# Altium project PCB_Project.PrjPcb
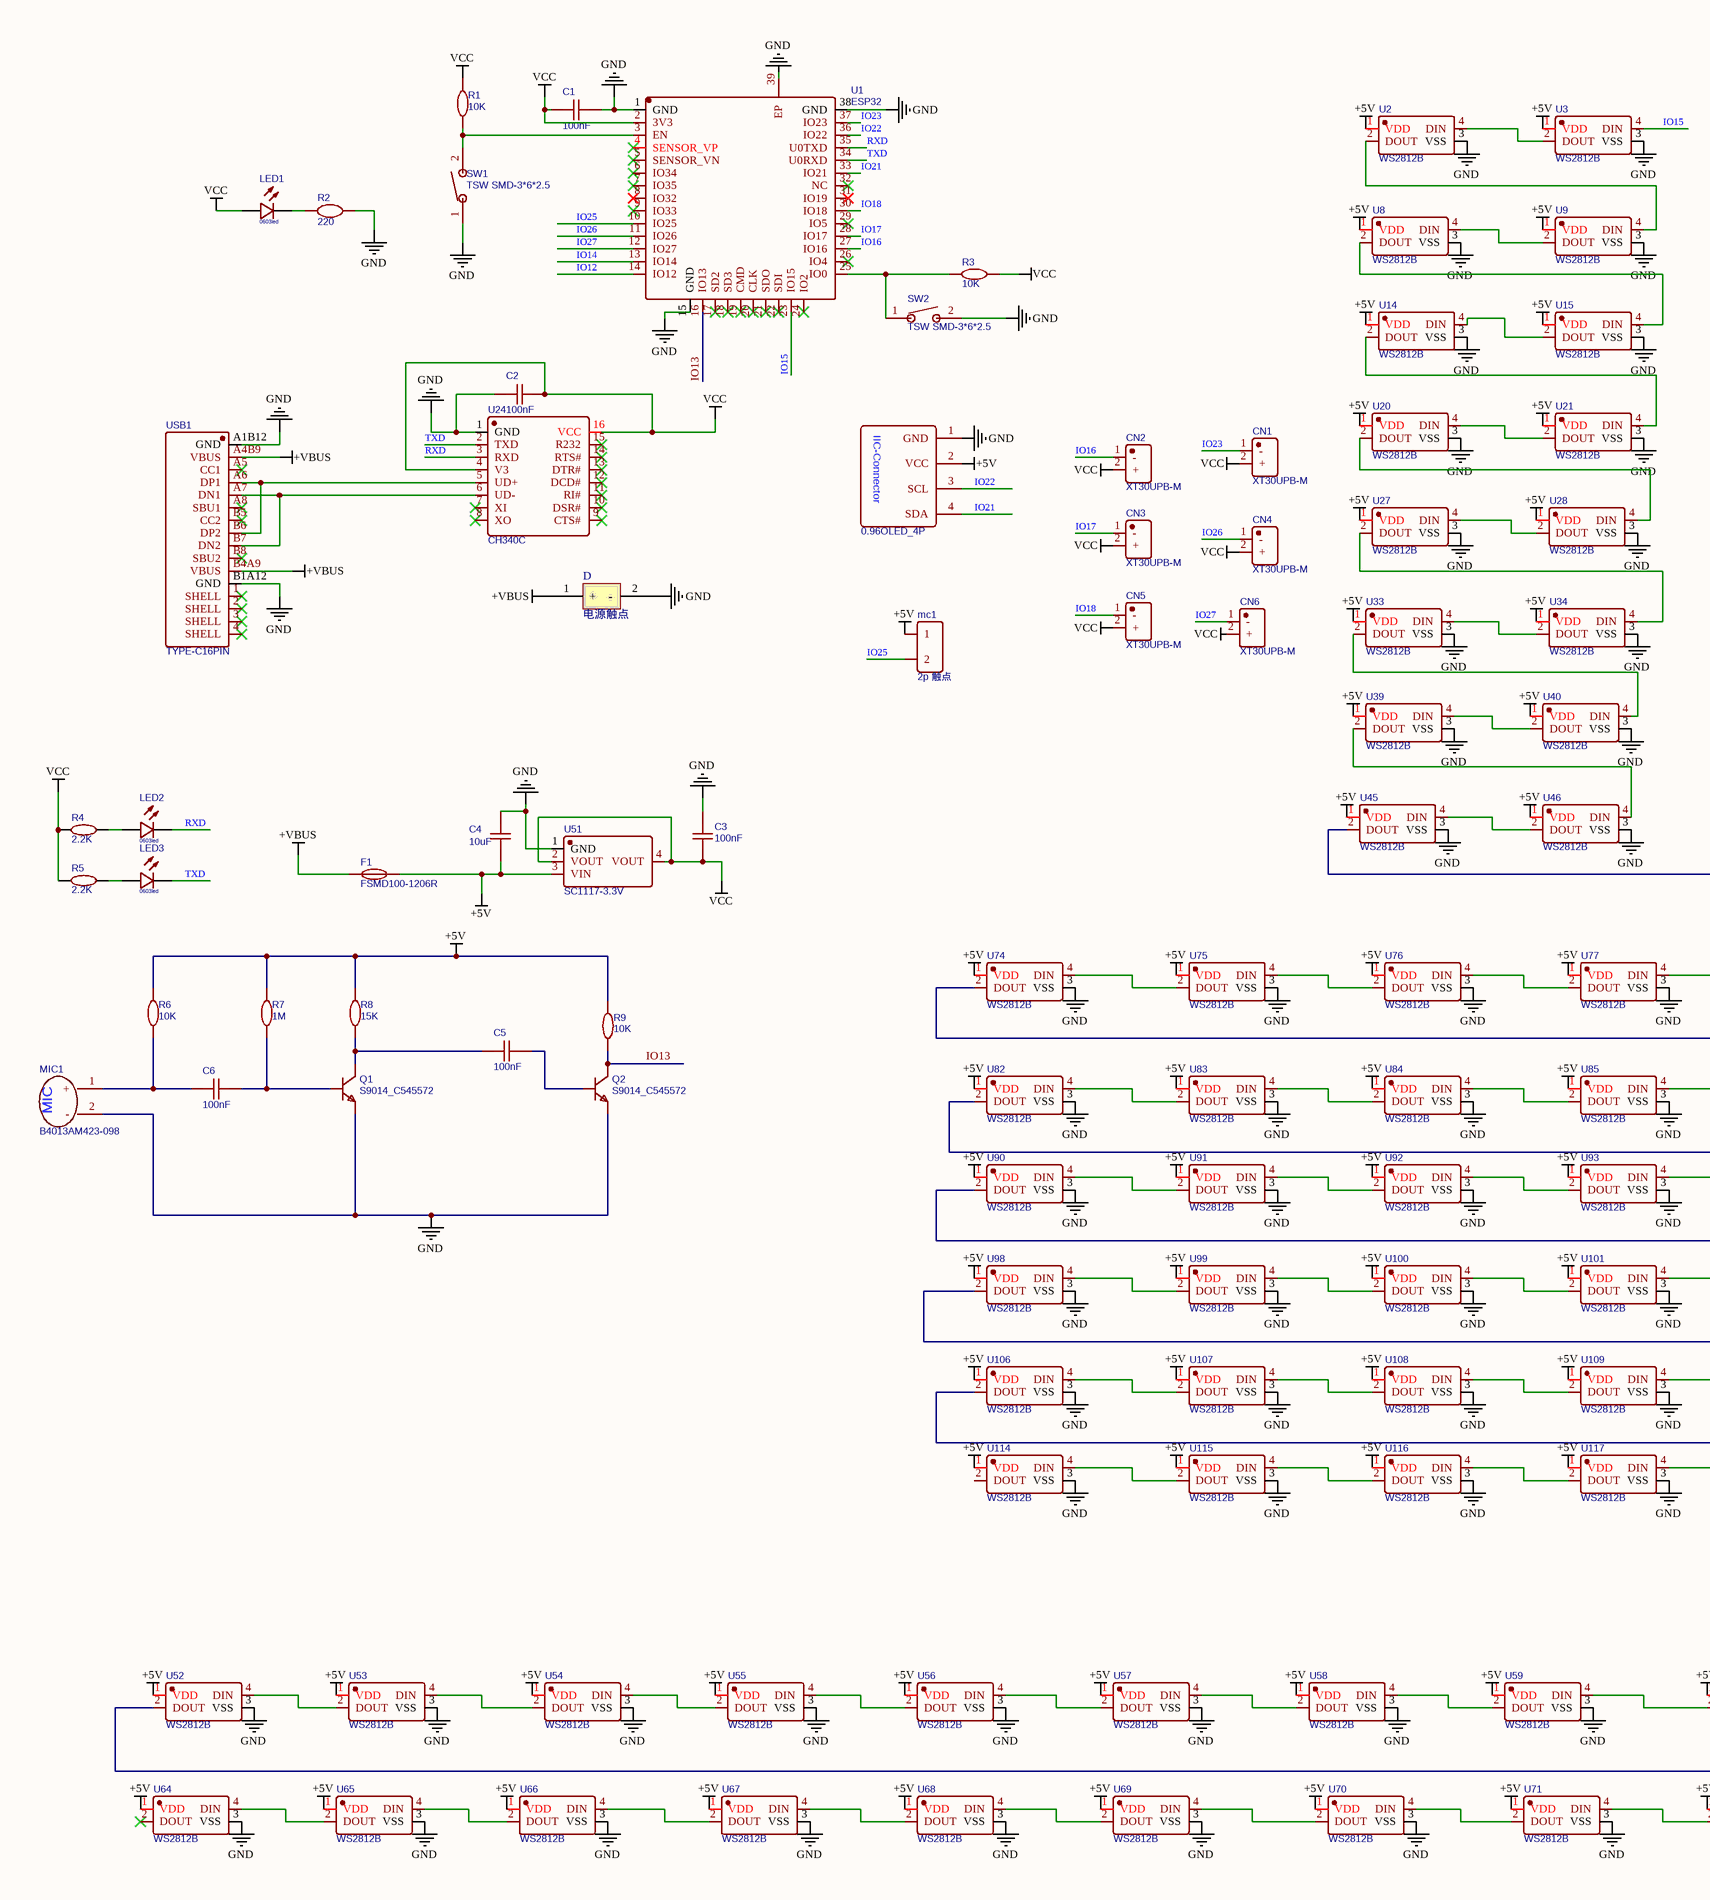
[diagram p0: Sheet1.SchDoc, left]
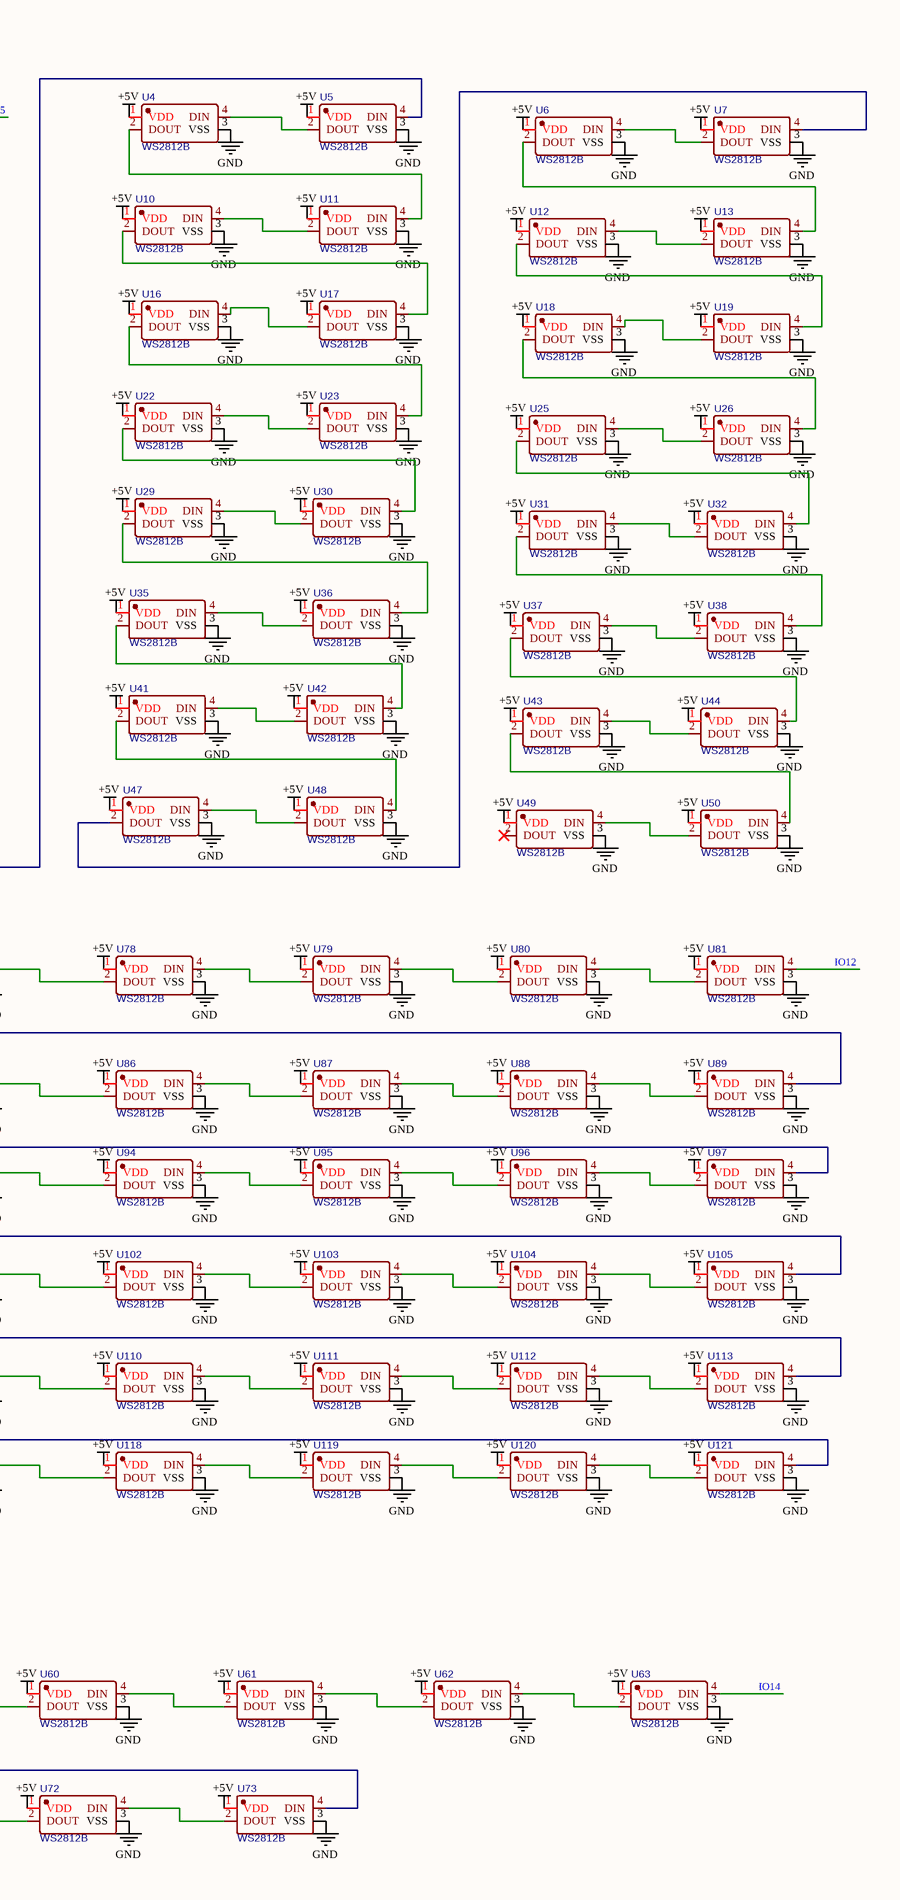
[diagram p1: Sheet1.SchDoc, right]
1 sheet, 155 parts. Net scope: global (net labels, ports and power ports of the same name join across sheets).
Board files: PCB1.PcbDoc, PCB2.PcbDoc, PCB3.PcbDoc, PCB4.PcbDoc, PCB5.PcbDoc, PCB6.PcbDoc, PCB7.PcbDoc

## Sheet Sheet1.SchDoc
size A2

### Parts
?  0.96OLED_4P  [OLED]
C1  100nF  [C 0603_M]
C2  100nF  [C 0603_M]
C3  100nF  [C 0603_M]
C4  10uF  [C 0603_M]
C5  100nF  [C 0603_M]
C6  100nF  [C 0603_M]
CN1  XT30UPB-M  [XT30UPB-M]
CN2  XT30UPB-M  [XT30UPB-M]
CN3  XT30UPB-M  [XT30UPB-M]
CN4  XT30UPB-M  [XT30UPB-M]
CN5  XT30UPB-M  [XT30UPB-M]
CN6  XT30UPB-M  [XT30UPB-M]
D  电源触点  [触点]
F1  FSMD100-1206R  [FSMD100-1206R]
LED1  0603led  [LED]
LED2  0603led  [LED]
LED3  0603led  [LED]
mc1  2p 触点  [PCBComponent_1]
MIC1  B4013AM423-098  [MIC-SMD_BD4.0]
Q1  S9014_C545572  [SOT23]
Q2  S9014_C545572  [SOT23]
R1  10K  [R 0603_L]
R2  220  [R 0603_L]
R3  10K  [R 0603_L]
R4  2.2K  [R 0603_L]
R5  2.2K  [R 0603_L]
R6  10K  [R 0603_L]
R7  1M  [R 0603_L]
R8  15K  [R 0603_L]
R9  10K  [R 0603_L]
SW1  TSW SMD-3*6*2.5  [TSW SMD-3*6*2.5]
SW2  TSW SMD-3*6*2.5  [TSW SMD-3*6*2.5]
U1  ESP32  [ESP32]
U2  WS2812B  [WS2812B_5050]
U3  WS2812B  [WS2812B_5050]
U4  WS2812B  [WS2812B_5050]
U5  WS2812B  [WS2812B_5050]
U6  WS2812B  [WS2812B_5050]
U7  WS2812B  [WS2812B_5050]
U8  WS2812B  [WS2812B_5050]
U9  WS2812B  [WS2812B_5050]
U10  WS2812B  [WS2812B_5050]
U11  WS2812B  [WS2812B_5050]
U12  WS2812B  [WS2812B_5050]
U13  WS2812B  [WS2812B_5050]
U14  WS2812B  [WS2812B_5050]
U15  WS2812B  [WS2812B_5050]
U16  WS2812B  [WS2812B_5050]
U17  WS2812B  [WS2812B_5050]
U18  WS2812B  [WS2812B_5050]
U19  WS2812B  [WS2812B_5050]
U20  WS2812B  [WS2812B_5050]
U21  WS2812B  [WS2812B_5050]
U22  WS2812B  [WS2812B_5050]
U23  WS2812B  [WS2812B_5050]
U24  CH340C  [CH340C]
U25  WS2812B  [WS2812B_5050]
U26  WS2812B  [WS2812B_5050]
U27  WS2812B  [WS2812B_5050]
U28  WS2812B  [WS2812B_5050]
U29  WS2812B  [WS2812B_5050]
U30  WS2812B  [WS2812B_5050]
U31  WS2812B  [WS2812B_5050]
U32  WS2812B  [WS2812B_5050]
U33  WS2812B  [WS2812B_5050]
U34  WS2812B  [WS2812B_5050]
U35  WS2812B  [WS2812B_5050]
U36  WS2812B  [WS2812B_5050]
U37  WS2812B  [WS2812B_5050]
U38  WS2812B  [WS2812B_5050]
U39  WS2812B  [WS2812B_5050]
U40  WS2812B  [WS2812B_5050]
U41  WS2812B  [WS2812B_5050]
U42  WS2812B  [WS2812B_5050]
U43  WS2812B  [WS2812B_5050]
U44  WS2812B  [WS2812B_5050]
U45  WS2812B  [WS2812B_5050]
U46  WS2812B  [WS2812B_5050]
U47  WS2812B  [WS2812B_5050]
U48  WS2812B  [WS2812B_5050]
U49  WS2812B  [WS2812B_5050]
U50  WS2812B  [WS2812B_5050]
U51  SC1117-3.3V  [SC1117-3.3V]
U52  WS2812B  [WS2812B_5050]
U53  WS2812B  [WS2812B_5050]
U54  WS2812B  [WS2812B_5050]
U55  WS2812B  [WS2812B_5050]
U56  WS2812B  [WS2812B_5050]
U57  WS2812B  [WS2812B_5050]
U58  WS2812B  [WS2812B_5050]
U59  WS2812B  [WS2812B_5050]
U60  WS2812B  [WS2812B_5050]
U61  WS2812B  [WS2812B_5050]
U62  WS2812B  [WS2812B_5050]
U63  WS2812B  [WS2812B_5050]
U64  WS2812B  [WS2812B_5050]
U65  WS2812B  [WS2812B_5050]
U66  WS2812B  [WS2812B_5050]
U67  WS2812B  [WS2812B_5050]
U68  WS2812B  [WS2812B_5050]
U69  WS2812B  [WS2812B_5050]
U70  WS2812B  [WS2812B_5050]
U71  WS2812B  [WS2812B_5050]
U72  WS2812B  [WS2812B_5050]
U73  WS2812B  [WS2812B_5050]
U74  WS2812B  [WS2812B_5050]
U75  WS2812B  [WS2812B_5050]
U76  WS2812B  [WS2812B_5050]
U77  WS2812B  [WS2812B_5050]
U78  WS2812B  [WS2812B_5050]
U79  WS2812B  [WS2812B_5050]
U80  WS2812B  [WS2812B_5050]
U81  WS2812B  [WS2812B_5050]
U82  WS2812B  [WS2812B_5050]
U83  WS2812B  [WS2812B_5050]
U84  WS2812B  [WS2812B_5050]
U85  WS2812B  [WS2812B_5050]
U86  WS2812B  [WS2812B_5050]
U87  WS2812B  [WS2812B_5050]
U88  WS2812B  [WS2812B_5050]
U89  WS2812B  [WS2812B_5050]
U90  WS2812B  [WS2812B_5050]
U91  WS2812B  [WS2812B_5050]
U92  WS2812B  [WS2812B_5050]
U93  WS2812B  [WS2812B_5050]
U94  WS2812B  [WS2812B_5050]
U95  WS2812B  [WS2812B_5050]
U96  WS2812B  [WS2812B_5050]
U97  WS2812B  [WS2812B_5050]
U98  WS2812B  [WS2812B_5050]
U99  WS2812B  [WS2812B_5050]
U100  WS2812B  [WS2812B_5050]
U101  WS2812B  [WS2812B_5050]
U102  WS2812B  [WS2812B_5050]
U103  WS2812B  [WS2812B_5050]
U104  WS2812B  [WS2812B_5050]
U105  WS2812B  [WS2812B_5050]
U106  WS2812B  [WS2812B_5050]
U107  WS2812B  [WS2812B_5050]
U108  WS2812B  [WS2812B_5050]
U109  WS2812B  [WS2812B_5050]
U110  WS2812B  [WS2812B_5050]
U111  WS2812B  [WS2812B_5050]
U112  WS2812B  [WS2812B_5050]
U113  WS2812B  [WS2812B_5050]
U114  WS2812B  [WS2812B_5050]
U115  WS2812B  [WS2812B_5050]
U116  WS2812B  [WS2812B_5050]
U117  WS2812B  [WS2812B_5050]
U118  WS2812B  [WS2812B_5050]
U119  WS2812B  [WS2812B_5050]
U120  WS2812B  [WS2812B_5050]
U121  WS2812B  [WS2812B_5050]
USB1  TYPE-C16PIN  [TYPE-C16PIN]

### Nets
+5V: ?.2(VCC) C4.1 F1.2 mc1.1 R6.2 R7.2 R8.2 R9.2 U2.1(VDD) U3.1(VDD) U4.1(VDD) U5.1(VDD) U6.1(VDD) U7.1(VDD) U8.1(VDD) U9.1(VDD) U10.1(VDD) U11.1(VDD) U12.1(VDD) U13.1(VDD) U14.1(VDD) U15.1(VDD) U16.1(VDD) U17.1(VDD) U18.1(VDD) U19.1(VDD) U20.1(VDD) U21.1(VDD) U22.1(VDD) U23.1(VDD) U25.1(VDD) U26.1(VDD) U27.1(VDD) U28.1(VDD) U29.1(VDD) U30.1(VDD) U31.1(VDD) U32.1(VDD) U33.1(VDD) U34.1(VDD) U35.1(VDD) U36.1(VDD) U37.1(VDD) U38.1(VDD) U39.1(VDD) U40.1(VDD) U41.1(VDD) U42.1(VDD) U43.1(VDD) U44.1(VDD) U45.1(VDD) U46.1(VDD) U47.1(VDD) U48.1(VDD) U49.1(VDD) U50.1(VDD) U51.3(VIN) U52.1(VDD) U53.1(VDD) U54.1(VDD) U55.1(VDD) U56.1(VDD) U57.1(VDD) U58.1(VDD) U59.1(VDD) U60.1(VDD) U61.1(VDD) U62.1(VDD) U63.1(VDD) U64.1(VDD) U65.1(VDD) U66.1(VDD) U67.1(VDD) U68.1(VDD) U69.1(VDD) U70.1(VDD) U71.1(VDD) U72.1(VDD) U73.1(VDD) U74.1(VDD) U75.1(VDD) U76.1(VDD) U77.1(VDD) U78.1(VDD) U79.1(VDD) U80.1(VDD) U81.1(VDD) U82.1(VDD) U83.1(VDD) U84.1(VDD) U85.1(VDD) U86.1(VDD) U87.1(VDD) U88.1(VDD) U89.1(VDD) U90.1(VDD) U91.1(VDD) U92.1(VDD) U93.1(VDD) U94.1(VDD) U95.1(VDD) U96.1(VDD) U97.1(VDD) U98.1(VDD) U99.1(VDD) U100.1(VDD) U101.1(VDD) U102.1(VDD) U103.1(VDD) U104.1(VDD) U105.1(VDD) U106.1(VDD) U107.1(VDD) U108.1(VDD) U109.1(VDD) U110.1(VDD) U111.1(VDD) U112.1(VDD) U113.1(VDD) U114.1(VDD) U115.1(VDD) U116.1(VDD) U117.1(VDD) U118.1(VDD) U119.1(VDD) U120.1(VDD) U121.1(VDD)
+VBUS: D.1(+) F1.1 USB1.A4B9(VBUS) USB1.B4A9(VBUS)
GND: ?.1(GND) C1.2 C2.1 C3.2 C4.2 D.2(-) MIC1.2(-) Q1.2(E) Q2.2(E) R2.2 SW1.1 SW2.2 U1.1(GND) U1.15(GND) U1.38(GND) U1.39(EP) U2.3(VSS) U3.3(VSS) U4.3(VSS) U5.3(VSS) U6.3(VSS) U7.3(VSS) U8.3(VSS) U9.3(VSS) U10.3(VSS) U11.3(VSS) U12.3(VSS) U13.3(VSS) U14.3(VSS) U15.3(VSS) U16.3(VSS) U17.3(VSS) U18.3(VSS) U19.3(VSS) U20.3(VSS) U21.3(VSS) U22.3(VSS) U23.3(VSS) U24.1(GND) U25.3(VSS) U26.3(VSS) U27.3(VSS) U28.3(VSS) U29.3(VSS) U30.3(VSS) U31.3(VSS) U32.3(VSS) U33.3(VSS) U34.3(VSS) U35.3(VSS) U36.3(VSS) U37.3(VSS) U38.3(VSS) U39.3(VSS) U40.3(VSS) U41.3(VSS) U42.3(VSS) U43.3(VSS) U44.3(VSS) U45.3(VSS) U46.3(VSS) U47.3(VSS) U48.3(VSS) U49.3(VSS) U50.3(VSS) U51.1(GND) U52.3(VSS) U53.3(VSS) U54.3(VSS) U55.3(VSS) U56.3(VSS) U57.3(VSS) U58.3(VSS) U59.3(VSS) U60.3(VSS) U61.3(VSS) U62.3(VSS) U63.3(VSS) U64.3(VSS) U65.3(VSS) U66.3(VSS) U67.3(VSS) U68.3(VSS) U69.3(VSS) U70.3(VSS) U71.3(VSS) U72.3(VSS) U73.3(VSS) U74.3(VSS) U75.3(VSS) U76.3(VSS) U77.3(VSS) U78.3(VSS) U79.3(VSS) U80.3(VSS) U81.3(VSS) U82.3(VSS) U83.3(VSS) U84.3(VSS) U85.3(VSS) U86.3(VSS) U87.3(VSS) U88.3(VSS) U89.3(VSS) U90.3(VSS) U91.3(VSS) U92.3(VSS) U93.3(VSS) U94.3(VSS) U95.3(VSS) U96.3(VSS) U97.3(VSS) U98.3(VSS) U99.3(VSS) U100.3(VSS) U101.3(VSS) U102.3(VSS) U103.3(VSS) U104.3(VSS) U105.3(VSS) U106.3(VSS) U107.3(VSS) U108.3(VSS) U109.3(VSS) U110.3(VSS) U111.3(VSS) U112.3(VSS) U113.3(VSS) U114.3(VSS) U115.3(VSS) U116.3(VSS) U117.3(VSS) U118.3(VSS) U119.3(VSS) U120.3(VSS) U121.3(VSS) USB1.A1B12(GND) USB1.B1A12(GND)
VCC: C1.1 C2.2 C3.1 CN1.2(+) CN2.2(+) CN3.2(+) CN4.2(+) CN5.2(+) LED1.1(A) R1.2 R3.2 R4.1 R5.1 U1.2(3V3) U24.4(V3) U24.16(VCC) U51.2(VOUT) U51.4(VOUT)
IO12: U1.14(IO12) U81.4(DIN)
IO13: Q2.3(C) R9.1 U1.16(IO13)
IO14: U1.13(IO14) U63.4(DIN)
IO15: U1.23(IO15) U3.4(DIN)
IO16: CN2.1(-) U1.27(IO16)
IO17: CN3.1(-) U1.28(IO17)
IO18: CN5.1(-) U1.30(IO18)
IO21: ?.4(SDA) U1.33(IO21)
IO22: ?.3(SCL) U1.36(IO22)
IO23: CN1.1(-) U1.37(IO23)
IO25: mc1.2 U1.10(IO25)
IO26: CN4.1(-) U1.11(IO26)
IO27: CN6.1(-) U1.12(IO27)
RXD: LED2.2(C) U1.35(U0TXD) U24.3(RXD)
TXD: LED3.2(C) U1.34(U0RXD) U24.2(TXD)
NetC5_1: C5.1 Q1.3(C) R8.1
NetC5_2: C5.2 Q2.1
NetC6_1: C6.1 MIC1.1(+) R6.1
NetC6_2: C6.2 Q1.1 R7.1
NetLED1_2: LED1.2(C) R2.1
NetLED2_1: LED2.1(A) R4.2
NetLED3_1: LED3.1(A) R5.2
NetR1_1: R1.1 SW1.2 U1.3(EN)
NetR3_1: R3.1 SW2.1 U1.25(IO0)
NetU2_2: U2.2(DOUT) U9.4(DIN)
NetU2_4: U2.4(DIN) U3.2(DOUT)
NetU4_2: U4.2(DOUT) U11.4(DIN)
NetU4_4: U4.4(DIN) U5.2(DOUT)
NetU5_4: U5.4(DIN) U45.2(DOUT)
NetU6_2: U6.2(DOUT) U13.4(DIN)
NetU6_4: U6.4(DIN) U7.2(DOUT)
NetU7_4: U7.4(DIN) U47.2(DOUT)
NetU8_2: U8.2(DOUT) U15.4(DIN)
NetU8_4: U8.4(DIN) U9.2(DOUT)
NetU10_2: U10.2(DOUT) U17.4(DIN)
NetU10_4: U10.4(DIN) U11.2(DOUT)
NetU12_2: U12.2(DOUT) U19.4(DIN)
NetU12_4: U12.4(DIN) U13.2(DOUT)
NetU14_2: U14.2(DOUT) U21.4(DIN)
NetU14_4: U14.4(DIN) U15.2(DOUT)
NetU16_2: U16.2(DOUT) U23.4(DIN)
NetU16_4: U16.4(DIN) U17.2(DOUT)
NetU18_2: U18.2(DOUT) U26.4(DIN)
NetU18_4: U18.4(DIN) U19.2(DOUT)
NetU20_2: U20.2(DOUT) U28.4(DIN)
NetU20_4: U20.4(DIN) U21.2(DOUT)
NetU22_2: U22.2(DOUT) U30.4(DIN)
NetU22_4: U22.4(DIN) U23.2(DOUT)
NetU24_5: U24.5(UD+) USB1.A6(DP1) USB1.B6(DP2)
NetU24_6: U24.6(UD-) USB1.A7(DN1) USB1.B7(DN2)
NetU25_2: U25.2(DOUT) U32.4(DIN)
NetU25_4: U25.4(DIN) U26.2(DOUT)
NetU27_2: U27.2(DOUT) U34.4(DIN)
NetU27_4: U27.4(DIN) U28.2(DOUT)
NetU29_2: U29.2(DOUT) U36.4(DIN)
NetU29_4: U29.4(DIN) U30.2(DOUT)
NetU31_2: U31.2(DOUT) U38.4(DIN)
NetU31_4: U31.4(DIN) U32.2(DOUT)
NetU33_2: U33.2(DOUT) U40.4(DIN)
NetU33_4: U33.4(DIN) U34.2(DOUT)
NetU35_2: U35.2(DOUT) U42.4(DIN)
NetU35_4: U35.4(DIN) U36.2(DOUT)
NetU37_2: U37.2(DOUT) U44.4(DIN)
NetU37_4: U37.4(DIN) U38.2(DOUT)
NetU39_2: U39.2(DOUT) U46.4(DIN)
NetU39_4: U39.4(DIN) U40.2(DOUT)
NetU41_2: U41.2(DOUT) U48.4(DIN)
NetU41_4: U41.4(DIN) U42.2(DOUT)
NetU43_2: U43.2(DOUT) U50.4(DIN)
NetU43_4: U43.4(DIN) U44.2(DOUT)
NetU45_4: U45.4(DIN) U46.2(DOUT)
NetU47_4: U47.4(DIN) U48.2(DOUT)
NetU49_4: U49.4(DIN) U50.2(DOUT)
NetU52_2: U52.2(DOUT) U73.4(DIN)
NetU52_4: U52.4(DIN) U53.2(DOUT)
NetU53_4: U53.4(DIN) U54.2(DOUT)
NetU54_4: U54.4(DIN) U55.2(DOUT)
NetU55_4: U55.4(DIN) U56.2(DOUT)
NetU56_4: U56.4(DIN) U57.2(DOUT)
NetU57_4: U57.4(DIN) U58.2(DOUT)
NetU58_4: U58.4(DIN) U59.2(DOUT)
NetU59_4: U59.4(DIN) U60.2(DOUT)
NetU60_4: U60.4(DIN) U61.2(DOUT)
NetU61_4: U61.4(DIN) U62.2(DOUT)
NetU62_4: U62.4(DIN) U63.2(DOUT)
NetU64_4: U64.4(DIN) U65.2(DOUT)
NetU65_4: U65.4(DIN) U66.2(DOUT)
NetU66_4: U66.4(DIN) U67.2(DOUT)
NetU67_4: U67.4(DIN) U68.2(DOUT)
NetU68_4: U68.4(DIN) U69.2(DOUT)
NetU69_4: U69.4(DIN) U70.2(DOUT)
NetU70_4: U70.4(DIN) U71.2(DOUT)
NetU71_4: U71.4(DIN) U72.2(DOUT)
NetU72_4: U72.4(DIN) U73.2(DOUT)
NetU74_2: U74.2(DOUT) U89.4(DIN)
NetU74_4: U74.4(DIN) U75.2(DOUT)
NetU75_4: U75.4(DIN) U76.2(DOUT)
NetU76_4: U76.4(DIN) U77.2(DOUT)
NetU77_4: U77.4(DIN) U78.2(DOUT)
NetU78_4: U78.4(DIN) U79.2(DOUT)
NetU79_4: U79.4(DIN) U80.2(DOUT)
NetU80_4: U80.4(DIN) U81.2(DOUT)
NetU82_2: U82.2(DOUT) U97.4(DIN)
NetU82_4: U82.4(DIN) U83.2(DOUT)
NetU83_4: U83.4(DIN) U84.2(DOUT)
NetU84_4: U84.4(DIN) U85.2(DOUT)
NetU85_4: U85.4(DIN) U86.2(DOUT)
NetU86_4: U86.4(DIN) U87.2(DOUT)
NetU87_4: U87.4(DIN) U88.2(DOUT)
NetU88_4: U88.4(DIN) U89.2(DOUT)
NetU90_2: U90.2(DOUT) U105.4(DIN)
NetU90_4: U90.4(DIN) U91.2(DOUT)
NetU91_4: U91.4(DIN) U92.2(DOUT)
NetU92_4: U92.4(DIN) U93.2(DOUT)
NetU93_4: U93.4(DIN) U94.2(DOUT)
NetU94_4: U94.4(DIN) U95.2(DOUT)
NetU95_4: U95.4(DIN) U96.2(DOUT)
NetU96_4: U96.4(DIN) U97.2(DOUT)
NetU98_2: U98.2(DOUT) U113.4(DIN)
NetU98_4: U98.4(DIN) U99.2(DOUT)
NetU99_4: U99.4(DIN) U100.2(DOUT)
NetU100_4: U100.4(DIN) U101.2(DOUT)
NetU101_4: U101.4(DIN) U102.2(DOUT)
NetU102_4: U102.4(DIN) U103.2(DOUT)
NetU103_4: U103.4(DIN) U104.2(DOUT)
NetU104_4: U104.4(DIN) U105.2(DOUT)
NetU106_2: U106.2(DOUT) U121.4(DIN)
NetU106_4: U106.4(DIN) U107.2(DOUT)
NetU107_4: U107.4(DIN) U108.2(DOUT)
NetU108_4: U108.4(DIN) U109.2(DOUT)
NetU109_4: U109.4(DIN) U110.2(DOUT)
NetU110_4: U110.4(DIN) U111.2(DOUT)
NetU111_4: U111.4(DIN) U112.2(DOUT)
NetU112_4: U112.4(DIN) U113.2(DOUT)
NetU114_4: U114.4(DIN) U115.2(DOUT)
NetU115_4: U115.4(DIN) U116.2(DOUT)
NetU116_4: U116.4(DIN) U117.2(DOUT)
NetU117_4: U117.4(DIN) U118.2(DOUT)
NetU118_4: U118.4(DIN) U119.2(DOUT)
NetU119_4: U119.4(DIN) U120.2(DOUT)
NetU120_4: U120.4(DIN) U121.2(DOUT)

Not connected (* = marked no-connect by the designer): CN6 2(+); U1 4(SENSOR_VP)* 5(SENSOR_VN)* 6(IO34)* 7(IO35)* 8(IO32)* 9(IO33)* 17(SD2)* 18(SD3)* 19(CMD)* 20(CLK)* 21(SDO)* 22(SDI)* 24(IO2)* 26(IO4)* 29(IO5)* 31(IO19)* 32(NC)*; U24 7(XI)* 8(XO)* 9(CTS#)* 10(DSR#)* 11(RI#)* 12(DCD#)* 13(DTR#)* 14(RTS#)* 15(R232)*; U49 2(DOUT)*; U64 2(DOUT)*; U114 2(DOUT); USB1 1(SHELL)* 2(SHELL)* 3(SHELL)* 4(SHELL)* A5(CC1)* A8(SBU1)* B5(CC2)* B8(SBU2)*

### Notes on the sheet
- Labels drawn without touching a wire or pin: VCC
- Title
- Size:
- Date:
- File:
- A2
- Number:
- Time:
- Revision:
- Sheet
- of
- (in symbol 0.96OLED_4P) IIC-Connector
- (in symbol B4013AM423-098) MIC

### Library data of the parts
? = 0.96OLED_4P: BOM_Manufacturer: null; BOM_Manufacturer Part: 0.96OLED_4P_MODULE_JX; Contributor: LCSC; BOM_Supplier: LCSC; BOM_Supplier Part: C9900004566; spicePre: O; spiceSymbolName: 0.96OLED_4P_MODULE_JX
C1-C3 C5 C6 = 100nF: BOM_Manufacturer: YAGEO; BOM_Manufacturer Part: CC0603KRX7R9BB104; nameAlias: Capacitance; SMT Type: Basic; BOM_Supplier: LCSC; BOM_LCSC Assembly: Yes; BOM_Supplier Part: C14663; spicePre: C; spiceSymbolName: CC0603KRX7R9BB104
C4 = 10uF: BOM_Manufacturer: MuRata; BOM_Manufacturer Part: GRM188R61A106KE69D; nameAlias: Capacitance; BOM_Supplier: LCSC; BOM_Supplier Part: C77044; spicePre: C; spiceSymbolName: GRM188R61A106KE69D
CN1-CN6 = XT30UPB-M: BOM_Manufacturer: Changzhou Amass Elec; Contributor: LCSC; BOM_Supplier: LCSC; BOM_Supplier Part: C428721; BOM_Manufacturer Part: XT30UPB-M; BOM_JLCPCB Part Class: Extended Part; spicePre: C; spiceSymbolName: XT30UPB-M
F1 = FSMD100-1206R: BOM_Manufacturer: TECHFUSE; BOM_Manufacturer Part: 0603-075; BOM_Supplier: LCSC; BOM_Supplier Part: C70053; spicePre: F; spiceSymbolName: 0603-075
LED1-LED3 = 0603led: BOM_Manufacturer: EVERLIGHT; BOM_Manufacturer Part: 19-217/GHC-YR1S2/3T; SMT Type: Basic; BOM_Supplier: LCSC; BOM_LCSC Assembly: Yes; image: //image.lceda.cn/szlcsc/C72043.jpg; BOM_Supplier Part: C72043; spicePre: L; spiceSymbolName: 19-217/GHC-YR1S2/3T
mc1 = 2p 触点: BOM_Manufacturer: TE Connectivity; BOM_Manufacturer Part: 826629-2; Package Display: No; BOM_Supplier: LCSC; BOM_Supplier Part: C86471; BOM_JLCPCB Part Class: Extended Part; spicePre: H; spiceSymbolName: Header-Male-2.54_1x2
MIC1 = B4013AM423-098: BOM_Manufacturer: Goertek(歌尔); Contributor: LCSC; BOM_Supplier: LCSC; BOM_Supplier Part: C2835889; BOM_Manufacturer Part: B4013AM423-098; spicePre: M; spiceSymbolName: B4013AM423-098
Q1 Q2 = S9014_C545572: BOM_Manufacturer: UMW(Youtai Semiconductor Co., Ltd.); BOM_Manufacturer Part: S9014; Contributor: LCSC; BOM_Supplier: LCSC; BOM_Supplier Part: C545572; BOM_JLCPCB Part Class: Extended Part; spicePre: Q; spiceSymbolName: S9014_C545572
R1 R3 R6 R9 = 10K: BOM_Manufacturer: Stackpole Elec; BOM_Manufacturer Part: RMCF0603JT10K0; nameAlias: Resistance (Ohms); Contributor: LCSC; BOM_Supplier: LCSC; BOM_Supplier Part: C238881; spicePre: R; spiceSymbolName: RMCF0603JT10K0
R2 = 220: nameAlias: Value(Ω); Contributor: LCEDA_Lib; spicePre: R; spiceSymbolName: R_0603_EU
R4 R5 = 2.2K: BOM_Manufacturer: UniOhm; BOM_Manufacturer Part: 0603WAF2201T5E; nameAlias: Resistance (Ohms); SMT Type: Basic; BOM_Supplier: LCSC; BOM_LCSC Assembly: Yes; BOM_Supplier Part: C4190; spicePre: R; spiceSymbolName: 0603WAF2201T5E
R7 = 1M: BOM_Manufacturer: Stackpole Elec; BOM_Manufacturer Part: RMCF0603JT10K0; nameAlias: Resistance (Ohms); Contributor: LCSC; BOM_Supplier: LCSC; BOM_Supplier Part: C238881; spicePre: R; spiceSymbolName: RMCF0603JT10K0
R8 = 15K: BOM_Manufacturer: Stackpole Elec; BOM_Manufacturer Part: RMCF0603JT10K0; nameAlias: Resistance (Ohms); Contributor: LCSC; BOM_Supplier: LCSC; BOM_Supplier Part: C238881; spicePre: R; spiceSymbolName: RMCF0603JT10K0
SW1 SW2 = TSW SMD-3*6*2.5: BOM_Manufacturer: BRIGHT; BOM_Manufacturer Part: TSA343G00-250J2; Contributor: LCSC; BOM_Supplier: LCSC; BOM_Supplier Part: C354946; spicePre: S; spiceSymbolName: TSA343G00-250J2
U1 = ESP32: BOM_Manufacturer: Ai-Thinker; BOM_Manufacturer Part: ESP32-S; Contributor: LCSC; BOM_Supplier: LCSC; BOM_Supplier Part: C277944; spicePre: U; spiceSymbolName: ESP32-S
U2-U23 U25-U50 U52-U121 = WS2812B: BOM_Manufacturer: null; Contributor: LCSC; BOM_Supplier: LCSC; BOM_Supplier Part: C9900004137; BOM_Manufacturer Part: WS2812B; BOM_JLCPCB Part Class: Extended Part; spicePre: U; spiceSymbolName: WS2812B_C9900004137
U24 = CH340C: BOM_Manufacturer: WCH; SMT Type: Extend; BOM_Supplier: LCSC; BOM_Manufacturer Part: CH340C; BOM_Supplier Part: C84681; BOM_LCSC Assembly: Yes; spicePre: U; spiceSymbolName: CH340C
U51 = SC1117-3.3V: BOM_Manufacturer: FM; Contributor: LCSC; SMT Type: Extend; BOM_Supplier: LCSC; BOM_Manufacturer Part: SC1117-3.3V; BOM_Supplier Part: C173386; BOM_LCSC Assembly: Yes; spicePre: U; spiceSymbolName: SC1117-3.3V
USB1 = TYPE-C16PIN: BOM_Manufacturer: SHOU HAN; Contributor: LCSC; BOM_Supplier: LCSC; BOM_Supplier Part: C393939; BOM_Manufacturer Part: TYPE-C16PIN; spicePre: U; spiceSymbolName: TYPE-C16PIN